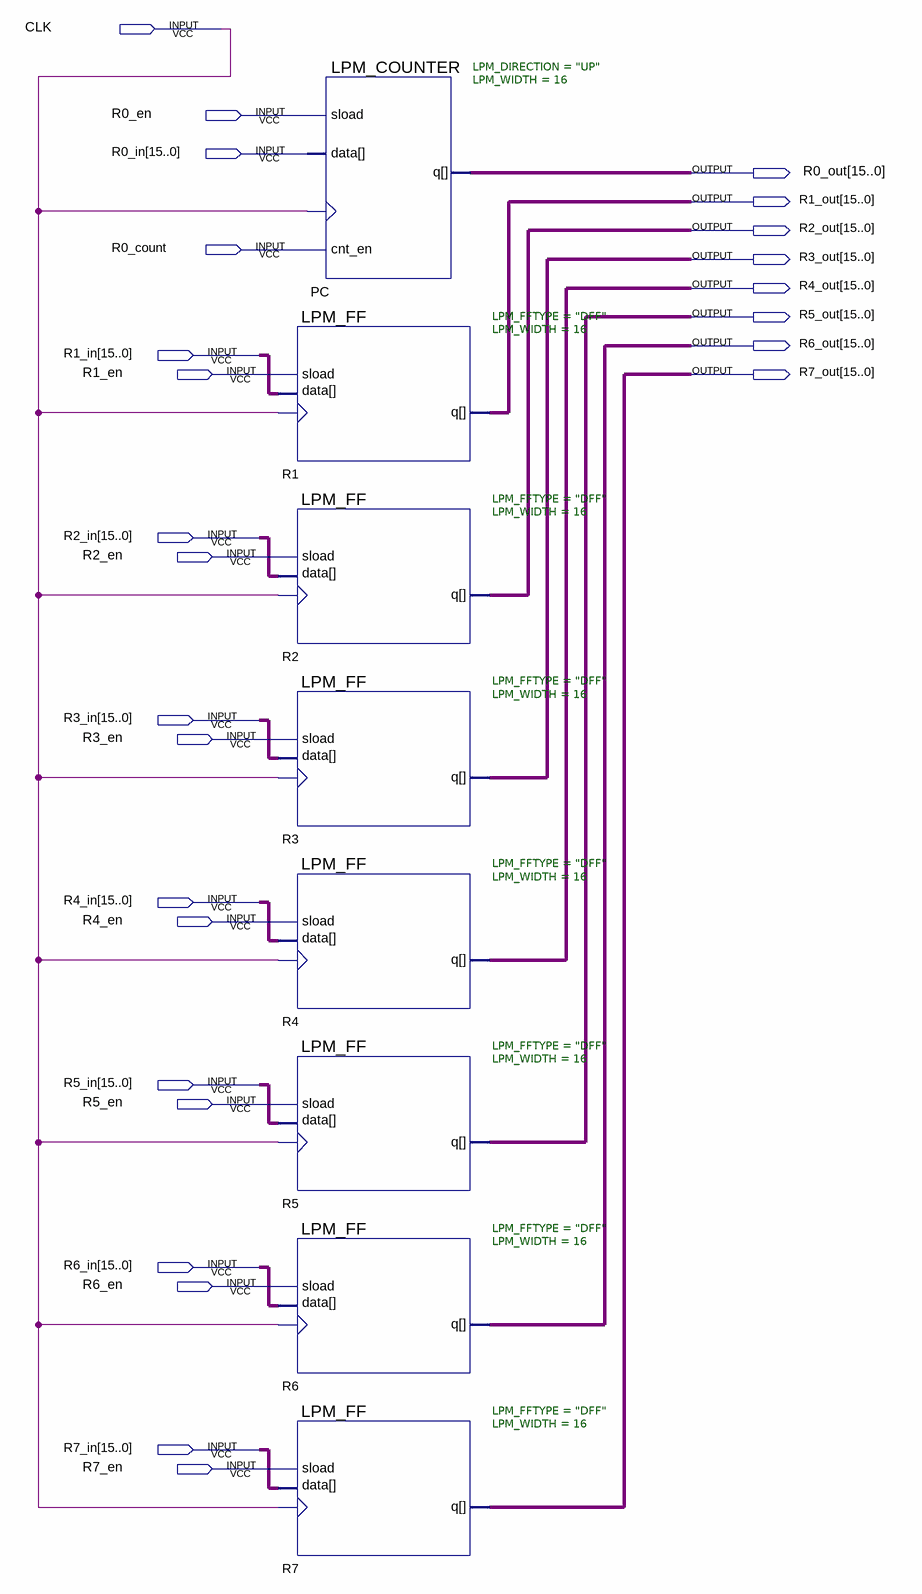
[diagram p0: schematic sheet]
// Quartus schematic reg_file.bdf as structural Verilog: 8 symbols, 26 pins
module reg_file (
  input  CLK,
  input  R0_en,
  input  [15:0] R0_in,
  input  R0_count,
  input  [15:0] R1_in,
  input  R1_en,
  input  [15:0] R2_in,
  input  R2_en,
  input  [15:0] R3_in,
  input  R3_en,
  input  [15:0] R4_in,
  input  R4_en,
  input  [15:0] R5_in,
  input  R5_en,
  input  [15:0] R6_in,
  input  R6_en,
  input  [15:0] R7_in,
  input  R7_en,
  output [15:0] R0_out,
  output [15:0] R1_out,
  output [15:0] R2_out,
  output [15:0] R3_out,
  output [15:0] R4_out,
  output [15:0] R5_out,
  output [15:0] R6_out,
  output [15:0] R7_out
);

  LPM_COUNTER #(.LPM_DIRECTION("UP"), .LPM_WIDTH(16)) PC (
    .clock(CLK), .cnt_en(R0_count), .data(R0_in), .sload(R0_en), .q(R0_out));
  LPM_FF #(.LPM_FFTYPE("DFF"), .LPM_WIDTH(16)) R1 (.clock(CLK), .data(R1_in), .sload(R1_en), .q(R1_out));
  LPM_FF #(.LPM_FFTYPE("DFF"), .LPM_WIDTH(16)) R2 (.clock(CLK), .data(R2_in), .sload(R2_en), .q(R2_out));
  LPM_FF #(.LPM_FFTYPE("DFF"), .LPM_WIDTH(16)) R3 (.clock(CLK), .data(R3_in), .sload(R3_en), .q(R3_out));
  LPM_FF #(.LPM_FFTYPE("DFF"), .LPM_WIDTH(16)) R4 (.clock(CLK), .data(R4_in), .sload(R4_en), .q(R4_out));
  LPM_FF #(.LPM_FFTYPE("DFF"), .LPM_WIDTH(16)) R5 (.clock(CLK), .data(R5_in), .sload(R5_en), .q(R5_out));
  LPM_FF #(.LPM_FFTYPE("DFF"), .LPM_WIDTH(16)) R6 (.clock(CLK), .data(R6_in), .sload(R6_en), .q(R6_out));
  LPM_FF #(.LPM_FFTYPE("DFF"), .LPM_WIDTH(16)) R7 (.clock(CLK), .data(R7_in), .sload(R7_en), .q(R7_out));
endmodule
